# Altium schematic sheet AD5324 Digital-to-Analog Converter.SchDoc: AD5324 Digital-to-Analog Converter
size Letter; SheetNumber: 12
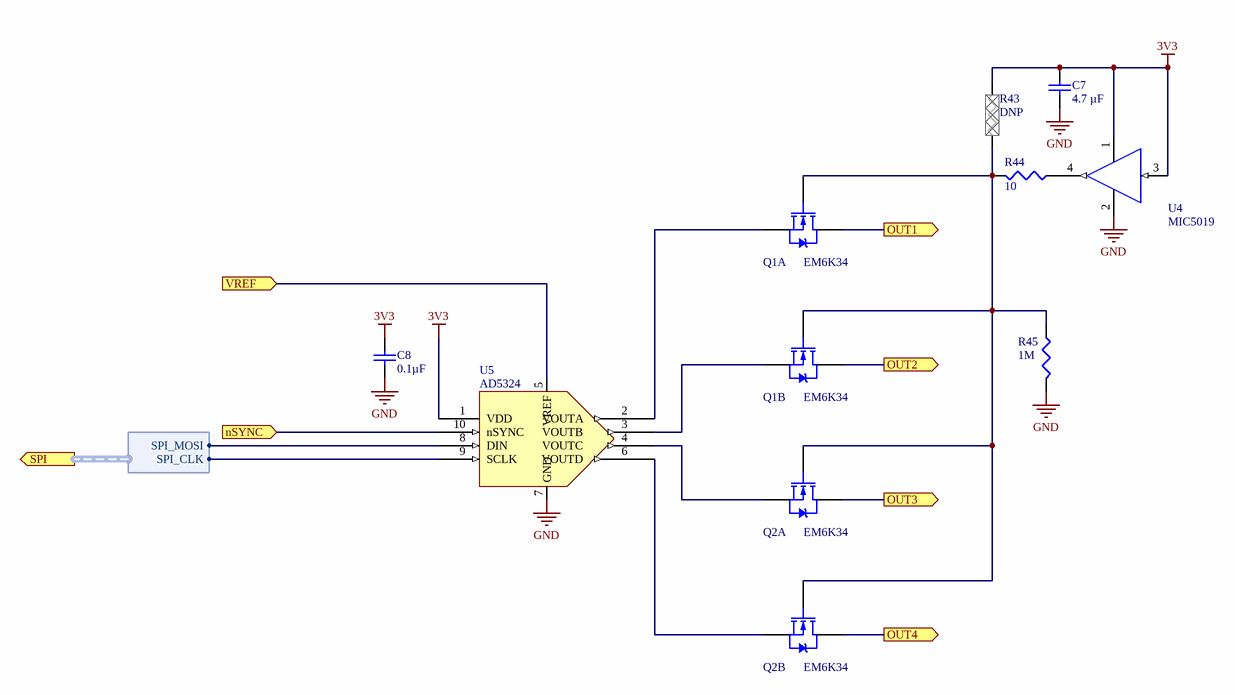
[diagram p0: AD5324 Digital-to-Analog Converter.SchDoc]

## Parts
C7  value 4.7 µF  [MUR-GRM188]  (hidden comment: Cap)
C8  value 0.1µF  [TDK-CGA2B]  (hidden comment: Cap)
Q1  EM6K34  [ROH-EMT6]  (parts A,B of 2)
Q2  EM6K34  [ROH-EMT6]  (parts A,B of 2)
R43  DNP  [PANA-ERA2A]  (no BOM)
R44  value 10  [PANA-ERA2A]  (hidden comment: Res3)
R45  value 1M  [PANA-ERJ2R]  (hidden comment: Res3)
U4  MIC5019  [MCP-MIC5019]
U5  AD5324  [ADI-RM-10]

## Ports
nSYNC (in), OUT1 (out), OUT2 (out), OUT3 (out), OUT4 (out), SPI (out, harness AD5324_SPI), VREF (in)

## Harnesses
AD5324_SPI: SPI_MOSI, SPI_CLK

## Nets
3V3: C7.2 C8.1 R43.2 U4.1(VDD) U4.3(IN) U5.1(VDD)
GND: C7.1 C8.2 R45.1 U4.2(GND) U5.7(GND)
nSYNC: U5.10(nSYNC) ; port nSYNC
OUT1: Q1.6(D1) ; port OUT1
OUT2: Q1.3(D2) ; port OUT2
OUT3: Q2.6(D1) ; port OUT3
OUT4: Q2.3(D2) ; port OUT4
VREF: U5.5(VREF) ; port VREF
NetQ1_1: Q1.1(G1) Q1.4(G2) Q2.1(G1) Q2.4(G2) R43.1 R44.2 R45.2
NetQ1_2: Q1.2(S1) U5.2(VOUTA)
NetQ1_5: Q1.5(S2) U5.3(VOUTB)
NetQ2_2: Q2.2(S1) U5.4(VOUTC)
NetQ2_5: Q2.5(S2) U5.6(VOUTD)
NetR44_1: R44.1 U4.4(OUT)
NetU5_8: U5.8(DIN) ; port SPI.SPI_MOSI
NetU5_9: U5.9(SCLK) ; port SPI.SPI_CLK

## Notes on the sheet
- (the "License"); you may not use or redistribute this file except in compliance with the License. You
- This file and the information within it are licensed under the terms of the Apache License, Version 2.0
- Copyright
- Unless required by applicable law or agreed to in writing, content distributed under the License is
- distributed on an "AS IS" BASIS, WITHOUT WARRANTIES OR CONDITIONS OF ANY KIND,
- either express or implied. See the License for the specific language governing permissions and
- limitations under the License.
- may obtain a copy of the License at:
- http://www.apache.org/licenses/LICENSE-2.0
- Title
- Size:
- Date:
- Letter
- Number:
- Time:
- Revision:
- Sheet
- of
- University of Alberta
- Deptartment of Electrical
- and Computer Engineering
- Edmonton AB, Canada
- T6G 1H9
- File:

## Library data of the parts
C7 = 10165: CAP CER 4.7UF 16V X7R 0603; Part Number: 10165; Manufacturer Part Number: GRM188Z71C475KE21D; Designator: C?; Tolerance: ±10%; Voltage - Rated: 25V; Published: 8-Jun-2000; LatestRevisionDate: 17-Jul-2002; LatestRevisionNote: Re-released for DXP Platform.; PackageReference: 0603 (1608 Metric); Publisher: Altium Limited; PackageDescription: Chip Capacitor, 2-Leads, Body 1.60x0.80mm, IPC Low Density; Supplier Part Number 1: 490-GRM188Z71C475KE21DCT-ND; Supplier 1: Digi-Key; Supplier Link: #https://www.digikey.ca/en/products/detail/murata-electronics/GRM188Z71C475KE21D/13401930#; Temperature Coefficient: X7R; Application: General Purpose; Operating Temperature: -55°C ~ 125°C; Supplier 2: Mouser; Supplier Part Number 2: 81-GRM188Z71C475KE1D
C8 = PC-TDK-02259: CAP CER 0.1UF 50V X7R 0402; Manufacturer Part Number: CGA2B3X7R1H104K050BB; Index: 2259; Designator: C?; Tolerance: ±10%; Published: 2016-03-16; LatestRevisionDate: 2016-03-16; LatestRevisionNote: ...; PackageReference: 0402 (1005 Metric); Publisher: AlbertaSat; PackageDescription: Radial Cap, Thru-Hole; 2 Leads; 0.3 in Pin Spacing; Part Number: PC-TDK-02259; Supplier Part Number 1: 445-6899-1-ND; Supplier 1: Digi-key; Supplier Link: http://www.digikey.ca/product-search/en?keywords=445-6899-1-ND; Voltage - Rated: 50V; Temperature Coefficient: X7R; Applications: Automotive; Operating Temperature: -55°C ~ 125°C
Q1 Q2 = PQ-ROH-00008: MOSFET 2N-CH 50V 0.2A EMT6; Index: 8; Designator: Q?; Power - Max: 120mW; Rds On (Max): 2.2Ohm @ 200mA, 4.5V; Vgs(th) (Max): 800mV @ 1mA; Part Number: PQ-ROH-00008; Manufacturer Part Number: EM6K34T2CR; Supplier Part Number 1: EM6K34T2CRCT-ND; Supplier 1: Digi-key; Supplier Part Number 2: 755-EM6K34T2CR; Supplier 2: Mouser; Publisher: AlbertaSat; Published: 2023-04-17; LatestRevisionDate: 2023-04-17; LatestRevisionNote: ...; PackageReference: SOT-563, SOT-666; PackageDescription: SOTFL, 6-Leads, Body 1.60x1.60mm, Pitch 0.50mm, IPC Medium Density; Supplier Link: #https://www.digikey.ca/en/products/detail/rohm-semiconductor/EM6K34T2CR/5042498#; Operating Temperature: -55°C ~ 150°C (TJ)
R43 = 19768: Part Number: 19768; Designator: R?; Value: DNP; PackageReference: 0402 (1005 Metric); PackageDescription: Chip Resistor, 2-Leads, Body 1.00x0.50mm, IPC Low Density
R44 = 13235: RES SMD 10 OHM 0.5% 1/16W 0402; Part Number: 13235; Manufacturer Part Number: ERA-2AKD100X; Designator: R?; Power: 0.063W, 1/16W; Temperature Coefficient: ±100ppm/°C; Published: 8-Jun-2000; LatestRevisionDate: 29-May-2009; LatestRevisionNote: IPC-7351 Footprint Added.; PackageReference: 0402 (1005 Metric); Publisher: Altium Limited; PackageDescription: Chip Resistor, 2-Leads, Body 1.00x0.50mm, IPC Low Density; Supplier Part Number 1: P10DDCT-ND; Supplier 1: Digi-Key; Supplier Link: http://www.digikey.ca/product-search/en?keywords=P10DDCT-ND; Tolerance: ±0.5%; Operating Temperature: -55°C ~ 155°C
R45 = 19704: RES SMD 1M OHM 1% 1/10W 0402; Part Number: 19704; Manufacturer Part Number: ERJ-2RKF1004X; Designator: R?; Power: 0.1W, 1/10W; Temperature Coefficient: ±100ppm/°C; Published: 8-Jun-2000; LatestRevisionDate: 29-May-2009; LatestRevisionNote: IPC-7351 Footprint Added.; PackageReference: 0402 (1005 Metric); Publisher: Altium Limited; PackageDescription: Chip Resistor, 2-Leads, Body 1.00x0.50mm, IPC Low Density; Supplier Part Number 1: P1.00MLCT-ND; Supplier 1: Digi-Key; Supplier Link: http://www.digikey.ca/product-search/en?keywords=P1.00MLCT-ND; Tolerance: ±1%; Operating Temperature: -55°C ~ 155°C
U4 = PU-MCP-00008: IC GATE DRVR HIGH-SIDE 4TQFN; Index: 8; Designator: U?; Part Number: PU-MCP-00008; Manufacturer Part Number: MIC5019YFT-TR; Supplier Part Number 1: 576-4152-1-ND; Supplier 1: Digi-key; Supplier Part Number 2: 998-MIC5019YFTTR; Supplier 2: Mouser; Publisher: AlbertaSat; Published: 2020-04-01; LatestRevisionDate: 2020-04-01; LatestRevisionNote: ...; PackageReference: 4-TQFN (1.2x1.2); Supplier Link: #https://www.digikey.ca/en/products/detail/microchip-technology/MIC5019YFT-TR/3681038#; Operating Temperature: -40°C ~ 125°C (TJ)
U5 = PU-ADI-00016: IC DAC 12BIT V-OUT 10MSOP; Index: 16; Designator: U?; Part Number: PU-ADI-00016; Manufacturer Part Number: AD5324BRMZ; Supplier Part Number 1: 505-AD5324BRMZ-ND; Supplier 1: Digi-key; Supplier Part Number 2: 584-AD5324BRMZ; Supplier 2: Mouser; Publisher: AlbertaSat; Published: 2023-05-04; LatestRevisionDate: 2023-05-04; LatestRevisionNote: ...; PackageReference: 10-MSOP; PackageDescription: TSSOP, 10-Leads, Body 3.00x3.00mm, Pitch 0.50mm, IPC Low Density; Supplier Link: #https://www.digikey.ca/en/products/detail/analog-devices-inc/AD5324BRMZ/653863#; Operating Temperature: -40°C ~ 105°C